# Altium schematic sheet SignalBoard.SchDoc
size A4
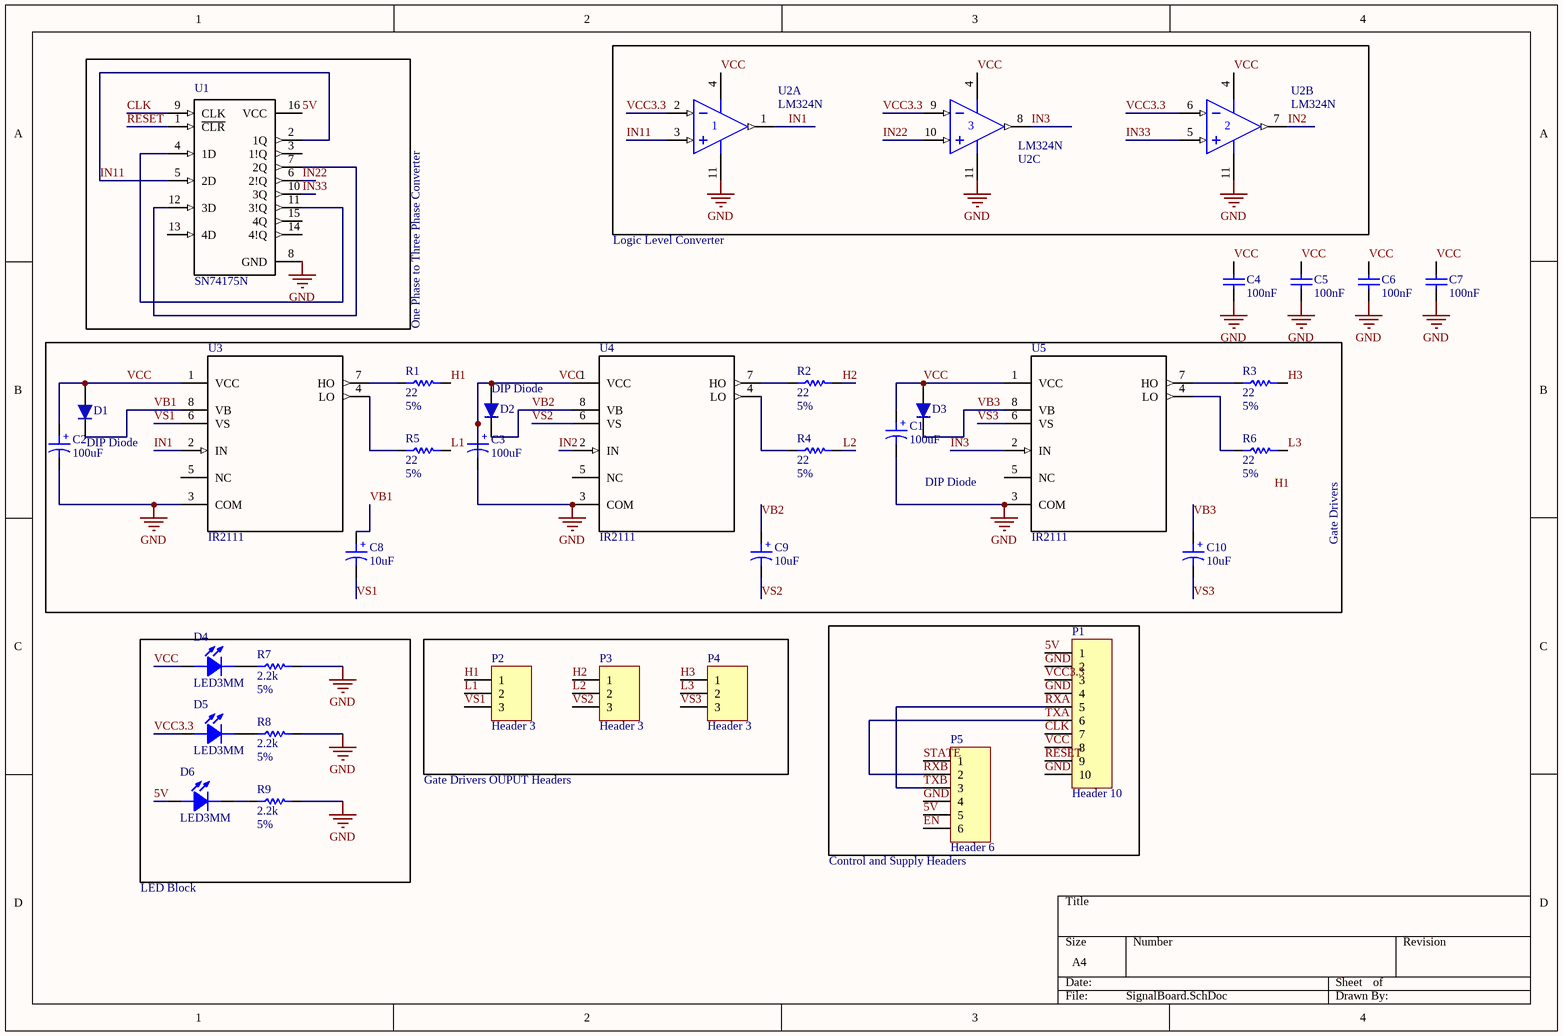
[diagram p0: SignalBoard.SchDoc]

## Parts
C1  100uF  [Cap electrolitic radial 6.3x12-2.5]
C2  100uF  [Cap electrolitic radial 6.3x12-2.5]
C3  100uF  [Cap electrolitic radial 6.3x12-2.5]
C4  100nF  [Cap-100nF]
C5  100nF  [Cap-100nF]
C6  100nF  [Cap-100nF]
C7  100nF  [Cap-100nF]
C8  10uF  [Cap electrolitic radial 5x11-2]
C9  10uF  [Cap electrolitic radial 5x11-2]
C10  10uF  [Cap electrolitic radial 5x11-2]
D1  DIP Diode  [Diode 1n4007]
D2  DIP Diode  [Diode 1n4007]
D3  DIP Diode  [Diode 1n4007]
D4  LED3MM  [LED3mm_GRN]
D5  LED3MM  [LED3mm_GRN]
D6  LED3MM  [LED3mm_GRN]
P1  Header 10  [HDR1X10]
P2  Header 3  [HDR1X3]
P3  Header 3  [HDR1X3]
P4  Header 3  [HDR1X3]
P5  Header 6  [HDR1X6]
R1  Tolerance: 5%  [Res-(1/4)]  (hidden comment: 22)
R2  Tolerance: 5%  [Res-(1/4)]  (hidden comment: 22)
R3  Tolerance: 5%  [Res-(1/4)]  (hidden comment: 22)
R4  Tolerance: 5%  [Res-(1/4)]  (hidden comment: 22)
R5  Tolerance: 5%  [Res-(1/4)]  (hidden comment: 22)
R6  Tolerance: 5%  [Res-(1/4)]  (hidden comment: 22)
R7  Tolerance: 5%  [Res-(1/4)]  (hidden comment: 2.2k)
R8  Tolerance: 5%  [Res-(1/4)]  (hidden comment: 2.2k)
R9  Tolerance: 5%  [Res-(1/4)]  (hidden comment: 2.2k)
U1  SN74175N  [*DIP762W46P254L2134H508Q16]
U2  LM324N  [646-06]  (parts A,B,C of 4)
U3  IR2111  [*DIP254P762X533-8]
U4  IR2111  [*DIP254P762X533-8]
U5  IR2111  [*DIP254P762X533-8]

## Blocks framed on the sheet
One Phase to Three Phase Converter: C1-C3 C8-C10 D1-D3 R1-R6 U3-U5

## Nets
GND: C1.2 C2.2 C3.2 C4.1 C5.1 C6.1 C7.1 P1.2 P1.4 P1.10 P5.4 R7.2 R8.2 R9.2 U1.8(GND) U2.11(V-) U3.3(COM) U4.3(COM) U5.3(COM)
5V: D6.1(ANODE) P1.1 P5.5 U1.16(VCC)
CLK: P1.7 U1.9(CLK)
EN: P5.6
H1: P2.1 R1.2
H2: P3.1 R2.2
H3: P4.1 R3.2
IN1: U2.1(OUT) U3.2(IN)
IN2: U2.7(OUT) U4.2(IN)
IN3: U2.8(OUT) U5.2(IN)
IN11: U1.2(1Q) U1.5(2D) U2.3(IN+)
IN22: U1.6(2!Q) U2.10(IN+)
IN33: U1.10(3Q) U2.5(IN+)
L1: P2.2 R5.2
L2: P3.2 R4.2
L3: P4.2 R6.2
RESET: P1.9 U1.1(~{CLR})
RXA: P1.5 P5.3  [also labelled TXB]
RXB: P1.6 P5.2  [also labelled TXA]
STATE: P5.1
VB1: C8.1 D1.2 U3.8(VB)
VB2: C9.1 D2.2 U4.8(VB)
VB3: C10.1 D3.2 U5.8(VB)
VCC: C1.1 C2.1 C3.1 C4.2 C5.2 C6.2 C7.2 D1.1 D2.1 D3.1 D4.1(ANODE) P1.8 U2.4(V+) U3.1(VCC) U4.1(VCC) U5.1(VCC)
VCC3.3: D5.1(ANODE) P1.3 U2.2(IN-) U2.6(IN-) U2.9(IN-)
VS1: C8.2 P2.3 U3.6(VS)
VS2: C9.2 P3.3 U4.6(VS)
VS3: C10.2 P4.3 U5.6(VS)
NetD4_2: D4.2(CATHODE) R7.1
NetD5_2: D5.2(CATHODE) R8.1
NetD6_2: D6.2(CATHODE) R9.1
NetR1_1: R1.1 U3.7(HO)
NetR2_1: R2.1 U4.7(HO)
NetR3_1: R3.1 U5.7(HO)
NetR4_1: R4.1 U4.4(LO)
NetR5_1: R5.1 U3.4(LO)
NetR6_1: R6.1 U5.4(LO)
NetU1_4: U1.4(1D) U1.11(3!Q)
NetU1_7: U1.7(2Q) U1.12(3D)

Not connected (* = marked no-connect by the designer): U1 3(1!Q) 13(4D) 14(4!Q) 15(4Q); U3 5(NC); U4 5(NC); U5 5(NC)

## Notes on the sheet
- Logic Level Converter
- Gate Drivers
- Gate Drivers OUPUT Headers
- LED Block
- (near P5) Control and Supply Headers
- Labels drawn without touching a wire or pin: H1
- (in symbol Cap ELECTROLITIC TOTAL SIZE) +

## Library data of the parts
C1-C3 C8-C10 = Cap ELECTROLITIC TOTAL SIZE: Cap electrolitic radial; Designer: Abbas Basereh; VALUE: 1uF; Data: 16-12-2016; Part. No: *
C4-C7 = CAP CERAMIC TOTAL SIZE: CAP Ceramic Total; Designer: Ali Hafizi
D1-D3 = Diode DIP Package: Published: 8-Jun-2000; LatestRevisionDate: 17-Jul-2002; LatestRevisionNote: Re-released for DXP Platform.; DatasheetVersion: 1997; Publisher: Altium Limited; PackageDescription: Diode, Axial; Body 3.8 x 1.9 mm (LxDia. max), Lead Dia. 0.53 mm (max); Code_JEDEC: DO-204-AH; ComponentLink1Description: Manufacturer Link; ComponentLink1URL: http://www.fairchildsemi.com/; ComponentLink2Description: Datasheet; ComponentLink2URL: http://www.fairchildsemi.com/ds/1N%2F1N4148.pdf
D4-D6 = LED 3MM: Light Emitting Diode; Designer: Ali Hafizi
P1 = Header 10: Header, 10-Pin; LatestRevisionDate: 17-Jul-2002; LatestRevisionNote: Re-released for DXP Platform.; Publisher: Altium Limited
P2-P4 = Header 3: Header, 3-Pin; LatestRevisionDate: 17-Jul-2002; LatestRevisionNote: Re-released for DXP Platform.; Publisher: Altium Limited
P5 = Header 6: Header, 6-Pin; LatestRevisionDate: 17-Jul-2002; LatestRevisionNote: Re-released for DXP Platform.; Publisher: Altium Limited
R1-R9 = Resistor
  R1-R6: Value: 22
  R7-R9: Value: 2.2k
U1 = SN74175N: Quadruple D-Type Flip-Flops With Clear 16-PDIP 0 to 70; MF: Texas Instruments; MP: SN74175N; Availability: Unavailable; SnapEDA_Link: https://www.snapeda.com/parts/SN74175N/Texas%20Instruments/view-part/?ref=snap; Package: PDIP-16 Texas Instruments; Price: None; Value: *
U2 = LM324N: Quad Low-Power Operational Amplifier; Published: 17-Jul-2002; LatestRevisionDate: 06-Jun-2005; LatestRevisionNote: Stylized 3D Model Added.; DatasheetVersion: 1988; PackageVersion: 1997; PackageReference: 646-06; Publisher: Altium Limited; PackageDescription: DIP; 14 Leads; Row Spacing 7.62 mm; Pitch 2.54 mm; ComponentLink1Description: Manufacturer Link; ComponentLink1URL: http://www.onsemi.com/site/products/parametrics/0,4446,251,00.html; ComponentLink2Description: Datasheet; ComponentLink2URL: http://www.onsemi.com/pub/Collateral/LM324-D.PDF
U3-U5 = IR2111: Half Bridge Driver, Fixed 650ns Deadtime in a 8-Lead package; MF: Infineon; Package: DIP-8 International Rectifier; Price: None; SnapEDA_Link: https://www.snapeda.com/parts/IR2111/Infineon%20Technologies/view-part/?ref=snap; MP: IR2111; Availability: Unavailable; Value: *